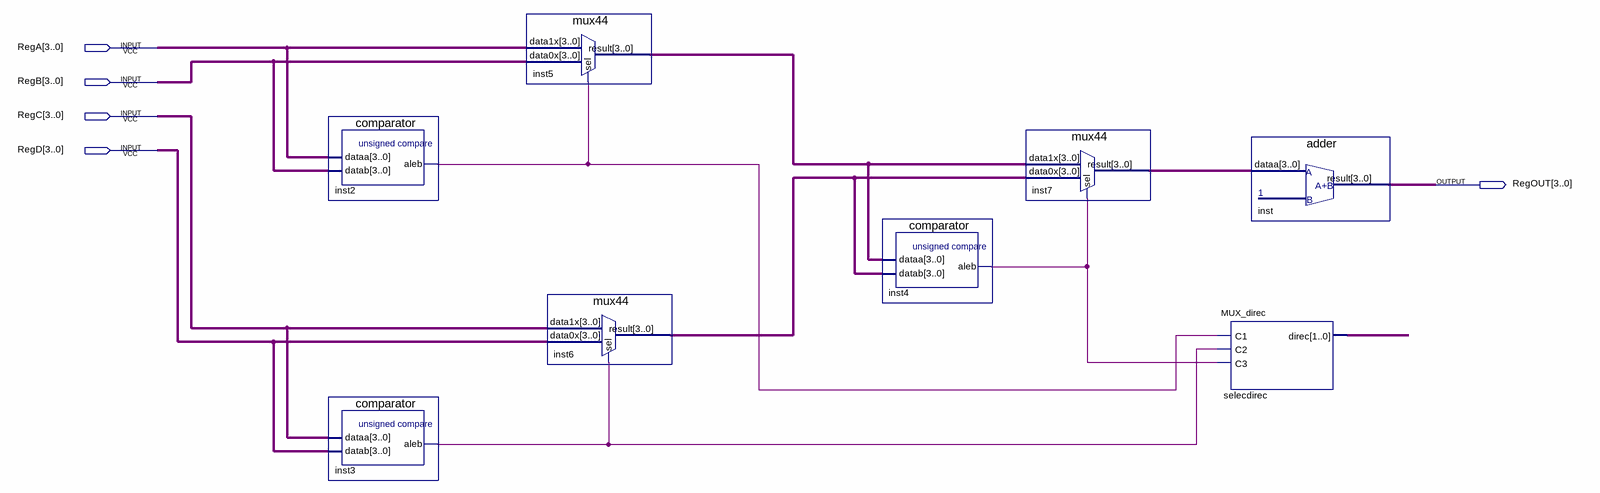
[diagram p0: schematic sheet]
// Quartus schematic ComparadorSumador4bit.bdf as structural Verilog: 8 symbols, 5 pins
module ComparadorSumador4bit (
  input  [3:0] RegA,
  input  [3:0] RegB,
  input  [3:0] RegC,
  input  [3:0] RegD,
  output [3:0] RegOUT
);

  wire inst2_aleb, inst3_aleb, inst4_aleb;
  wire [1:0] selecdirec_direc;
  wire [3:0] inst5_result, inst6_result, inst7_result;

  comparator inst2 (.dataa(RegA), .datab(RegB), .aleb(inst2_aleb));
  comparator inst3 (.dataa(RegC), .datab(RegD), .aleb(inst3_aleb));
  mux44 inst5 (.data1x(RegA), .data0x(RegB), .sel(inst2_aleb), .result(inst5_result));
  mux44 inst6 (.data1x(RegC), .data0x(RegD), .sel(inst3_aleb), .result(inst6_result));
  comparator inst4 (.dataa(inst5_result), .datab(inst6_result), .aleb(inst4_aleb));
  mux44 inst7 (.data1x(inst5_result), .data0x(inst6_result), .sel(inst4_aleb), .result(inst7_result));
  adder inst (.dataa(inst7_result), .result(RegOUT));
  MUX_direc selecdirec (.C1(inst2_aleb), .C2(inst3_aleb), .C3(inst4_aleb), .direc(selecdirec_direc));
endmodule
